# EAGLE schematic Druckluftcontroller (EAGLE 6.5.0)
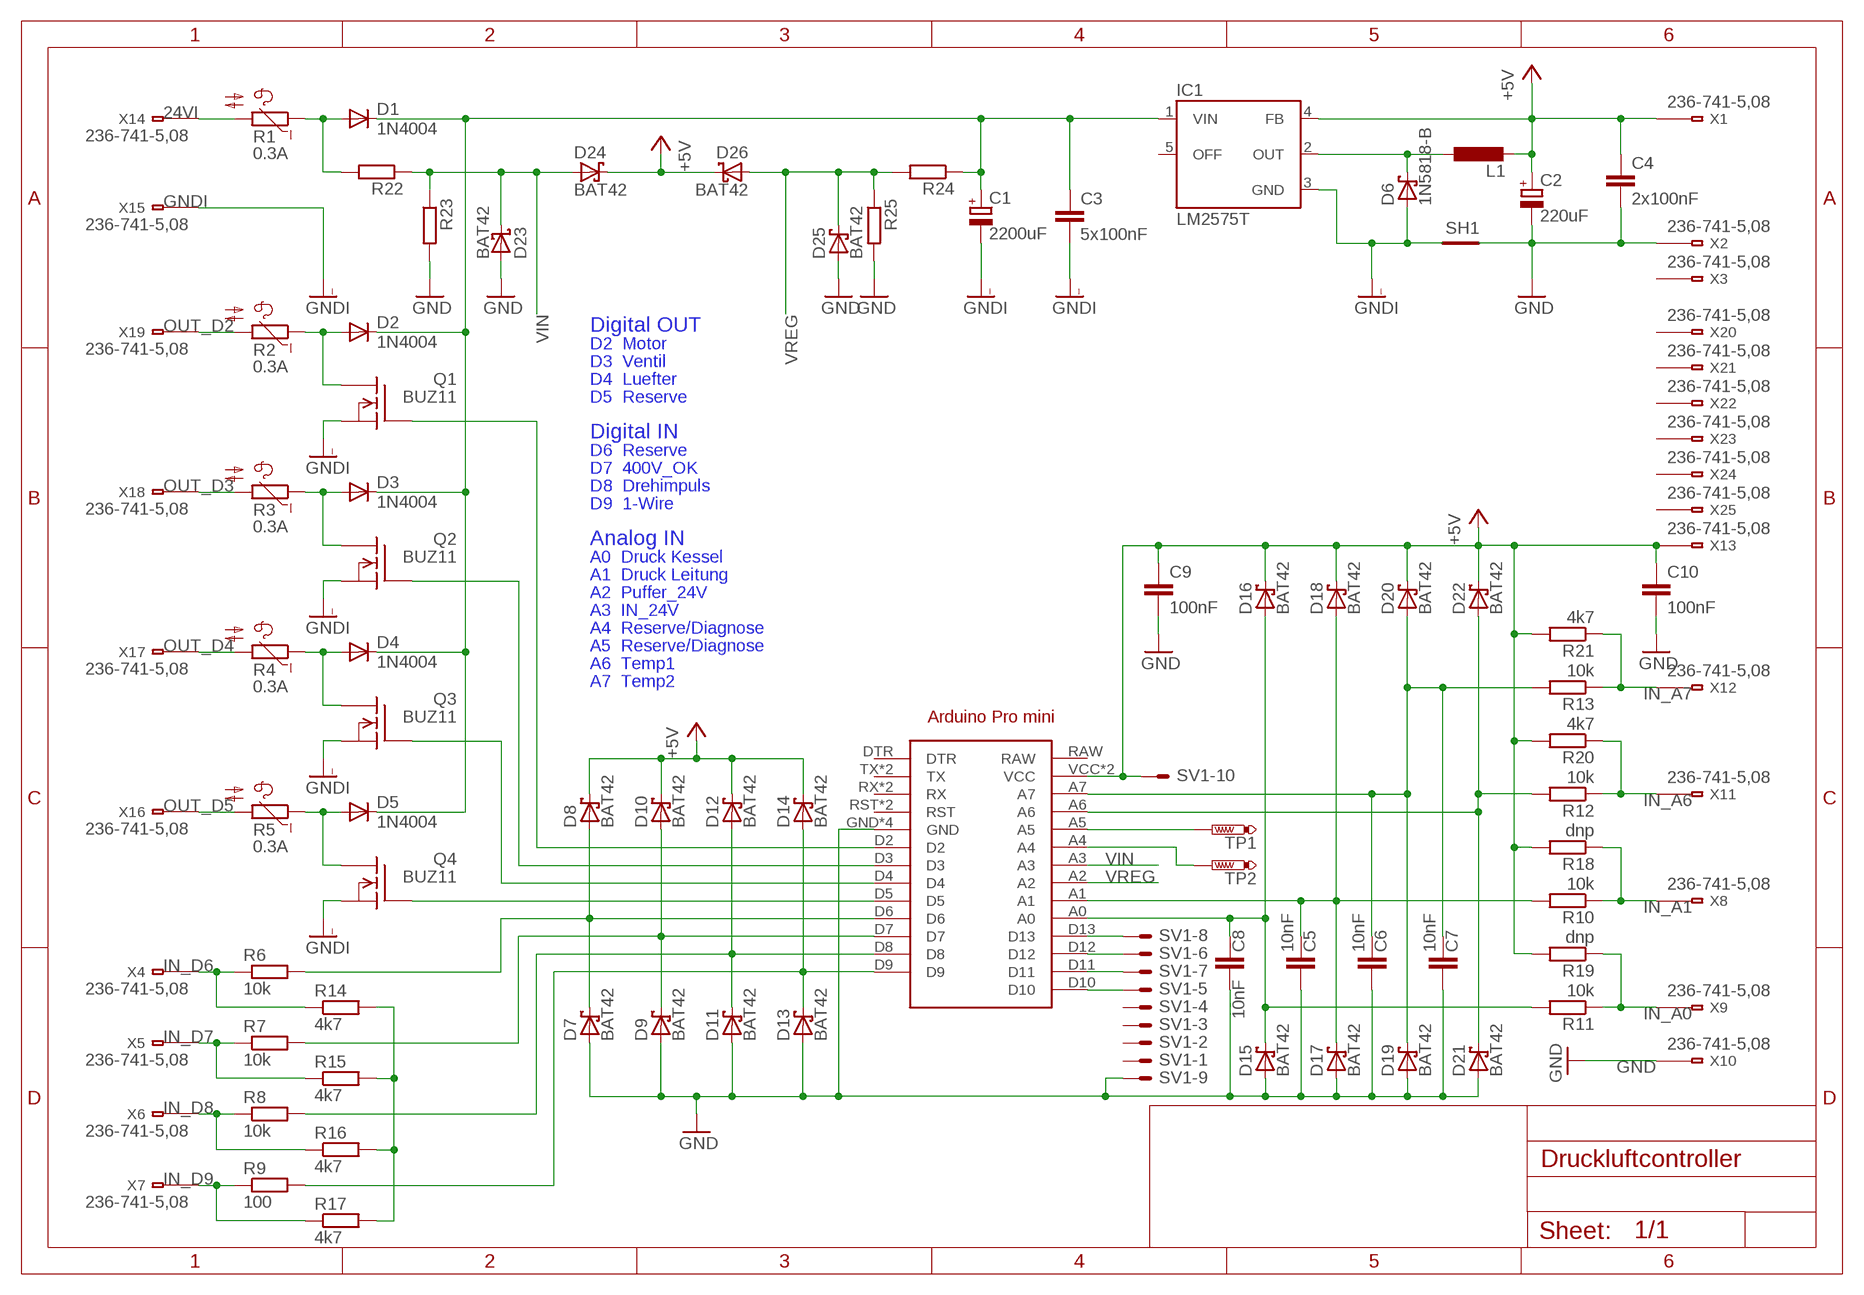
[diagram p0: schematic, sheet 1]

## Parts
ARDUINO1  ARDUINO_PRO_MINI  [ARDUINO_PRO_MINI]
C1  2200uF  CPOL-EUE7.5-16  [E7,5-16]
C2  220uF  CPOL-EUE7.5-16  [E7,5-16]
C3  5x100nF  C-EUC0805  [C0805]
C4  2x100nF  C-EUC0805  [C0805]
C5  10nF  C-EUC0805  [C0805]
C6  10nF  C-EUC0805  [C0805]
C7  10nF  C-EUC0805  [C0805]
C8  10nF  C-EUC0805  [C0805]
C9  100nF  C-EUC0805  [C0805]
C10  100nF  C-EUC0805  [C0805]
D1  1N4004  [DO41-10]
D2  1N4004  [DO41-10]
D3  1N4004  [DO41-10]
D4  1N4004  [DO41-10]
D5  1N4004  [DO41-10]
D6  1N5818-B  [DO41-7.6]
D7  BAT42  [DO35-10]
D8  BAT42  [DO35-10]
D9  BAT42  [DO35-10]
D10  BAT42  [DO35-10]
D11  BAT42  [DO35-10]
D12  BAT42  [DO35-10]
D13  BAT42  [DO35-10]
D14  BAT42  [DO35-10]
D15  BAT42  [DO35-10]
D16  BAT42  [DO35-10]
D17  BAT42  [DO35-10]
D18  BAT42  [DO35-10]
D19  BAT42  [DO35-10]
D20  BAT42  [DO35-10]
D21  BAT42  [DO35-10]
D22  BAT42  [DO35-10]
D23  BAT42  [DO35-10]
D24  BAT42  [DO35-10]
D25  BAT42  [DO35-10]
D26  BAT42  [DO35-10]
IC1  LM2575T  [TO220-5]
L1  L-EUTJ3-U2  [TJ3-U2]
Q1  BUZ11  [TO220]
Q2  BUZ11  [TO220]
Q3  BUZ11  [TO220]
Q4  BUZ11  [TO220]
R1  0.3A  V642  [P642]
R2  0.3A  V642  [P642]
R3  0.3A  V642  [P642]
R4  0.3A  V642  [P642]
R5  0.3A  V642  [P642]
R6  10k  R-EU_0204/7  [0204/7]
R7  10k  R-EU_0204/7  [0204/7]
R8  10k  R-EU_0204/7  [0204/7]
R9  100  R-EU_0204/7  [0204/7]
R10  10k  R-EU_0204/7  [0204/7]
R11  10k  R-EU_0204/7  [0204/7]
R12  10k  R-EU_0204/7  [0204/7]
R13  10k  R-EU_0204/7  [0204/7]
R14  4k7  R-EU_0204/7  [0204/7]
R15  4k7  R-EU_0204/7  [0204/7]
R16  4k7  R-EU_0204/7  [0204/7]
R17  4k7  R-EU_0204/7  [0204/7]
R18  dnp  R-EU_0204/7  [0204/7]
R19  dnp  R-EU_0204/7  [0204/7]
R20  4k7  R-EU_0204/7  [0204/7]
R21  4k7  R-EU_0204/7  [0204/7]
R22  R-EU_0204/7  [0204/7]
R23  R-EU_0204/7  [0204/7]
R24  R-EU_0204/7  [0204/7]
R25  R-EU_0204/7  [0204/7]
SH1  SHORTT5  [SHORT_TOP-50]
SV1  ML10E  [ML10]
TP1  PTR1PAD1-13  [P1-13]
TP2  PTR1PAD1-13  [P1-13]
X1  236-741-5,08  [236-4XX]
X2  236-741-5,08  [236-4XX]
X3  236-741-5,08  [236-4XX]
X4  236-741-5,08  [236-4XX]
X5  236-741-5,08  [236-4XX]
X6  236-741-5,08  [236-4XX]
X7  236-741-5,08  [236-4XX]
X8  236-741-5,08  [236-4XX]
X9  236-741-5,08  [236-4XX]
X10  236-741-5,08  [236-4XX]
X11  236-741-5,08  [236-4XX]
X12  236-741-5,08  [236-4XX]
X13  236-741-5,08  [236-4XX]
X14  236-741-5,08  [236-4XX]
X15  236-741-5,08  [236-4XX]
X16  236-741-5,08  [236-4XX]
X17  236-741-5,08  [236-4XX]
X18  236-741-5,08  [236-4XX]
X19  236-741-5,08  [236-4XX]
X20  236-741-5,08  [236-4XX]
X21  236-741-5,08  [236-4XX]
X22  236-741-5,08  [236-4XX]
X23  236-741-5,08  [236-4XX]
X24  236-741-5,08  [236-4XX]
X25  236-741-5,08  [236-4XX]

## Nets
24VI: R1.2 X14.1@2(B1)
+5V: ARDUINO1.VCC ARDUINO1.VCC@1(VCC) C2.+ C4.1 C9.1 C10.1 D8.C D10.C D12.C D14.C D16.C D18.C D20.C D22.C D24.C D26.C IC1.4(FB) L1.2 R18.2 R19.2 R20.2 R21.2 SV1.10 X1.1@2(B1) X13.1@2(B1)
GND: ARDUINO1.GND ARDUINO1.GND@1(GND) ARDUINO1.GND@2(GND) ARDUINO1.GND@3(GND) C2.- C4.2 C5.2 C6.2 C7.2 C8.2 C9.2 C10.2 D7.A D9.A D11.A D13.A D15.A D17.A D19.A D21.A D23.A D25.A R23.2 R25.2 SH1.2 SV1.9 X2.1@2(B1) X10.1@2(B1)
GNDI: C1.- C3.2 D6.A IC1.3(GND) Q1.3(S) Q2.3(S) Q3.3(S) Q4.3(S) SH1.1 X15.1@2(B1)
IN_A0: R11.1 R19.1 X9.1@2(B1)
IN_A1: R10.1 R18.1 X8.1@2(B1)
IN_A6: R12.1 R20.1 X11.1@2(B1)
IN_A7: R13.1 R21.1 X12.1@2(B1)
IN_D6: R6.1 R14.1 X4.1@2(B1)
IN_D7: R7.1 R15.1 X5.1@2(B1)
IN_D8: R8.1 R16.1 X6.1@2(B1)
IN_D9: R9.1 R17.1 X7.1@2(B1)
N$1: R14.2 R15.2 R16.2 R17.2
N$2: D1.A R1.1 R22.2
N$3: ARDUINO1.D5 Q4.1(G)
N$4: ARDUINO1.A0 C8.1 D15.C D16.A R11.2
N$5: D2.A Q1.2(D) R2.1
N$6: ARDUINO1.D4 Q3.1(G)
N$7: ARDUINO1.D3 Q2.1(G)
N$8: ARDUINO1.A1 C5.1 D17.C D18.A R10.2
N$9: D3.A Q2.2(D) R3.1
N$10: ARDUINO1.D2 Q1.1(G)
N$11: ARDUINO1.A6 D21.C D22.A R12.2
N$12: D4.A Q3.2(D) R4.1
N$13: ARDUINO1.D6 D7.C D8.A R6.2
N$14: ARDUINO1.A4 TP2.TP
N$15: D5.A Q4.2(D) R5.1
N$16: C1.+ C3.1 D1.C D2.C D3.C D4.C D5.C IC1.1(VIN) R24.1
N$17: ARDUINO1.D7 D9.C D10.A R7.2
N$18: ARDUINO1.D8 D11.C D12.A R8.2
N$19: ARDUINO1.D9 D13.C D14.A R9.2
N$20: ARDUINO1.A5 TP1.TP
N$21: ARDUINO1.A7 C6.1 C7.1 D19.C D20.A R13.2
N$24: D6.C IC1.2(OUT) L1.1
N$29: ARDUINO1.D10 SV1.5
N$30: ARDUINO1.D11 SV1.7
N$31: ARDUINO1.D12 SV1.6
N$32: ARDUINO1.D13 SV1.8
OUT_D2: R2.2 X19.1@2(B1)
OUT_D3: R3.2 X18.1@2(B1)
OUT_D4: R4.2 X17.1@2(B1)
OUT_D5: R5.2 X16.1@2(B1)
VIN: ARDUINO1.A3 D23.C D24.A R22.1 R23.1
VREG: ARDUINO1.A2 D25.C D26.A R24.2 R25.1
Unconnected: ARDUINO1.DTR ARDUINO1.RAW ARDUINO1.RST ARDUINO1.RST@1(RST) ARDUINO1.RX ARDUINO1.RX@1(RX) ARDUINO1.TX ARDUINO1.TX@1(TX) IC1.5(OFF) SV1.1 SV1.2 SV1.3 SV1.4 X1.1@1(A1) X2.1@1(A1) X3.1@1(A1) X3.1@2(B1) X4.1@1(A1) X5.1@1(A1) X6.1@1(A1) X7.1@1(A1) X8.1@1(A1) X9.1@1(A1) X10.1@1(A1) X11.1@1(A1) X12.1@1(A1) X13.1@1(A1) X14.1@1(A1) X15.1@1(A1) X16.1@1(A1) X17.1@1(A1) X18.1@1(A1) X19.1@1(A1) X20.1@1(A1) X20.1@2(B1) X21.1@1(A1) X21.1@2(B1) X22.1@1(A1) X22.1@2(B1) X23.1@1(A1) X23.1@2(B1) X24.1@1(A1) X24.1@2(B1) X25.1@1(A1) X25.1@2(B1)

## Notes on the sheet
- Digital OUT
- D2  Motor
- D3  Ventil
- D4  Luefter
- D5  Reserve
- Digital IN
- D6  Reserve
- D7  400V_OK
- D8  Drehimpuls
- D9  1-Wire
- Analog IN
- A0  Druck Kessel
- A1  Druck Leitung
- A2  Puffer_24V
- A3  IN_24V
- A4  Reserve/Diagnose
- A5  Reserve/Diagnose
- A6  Temp1
- A7  Temp2

## Library data of the parts
ARDUINO1 = arduinopromini:ARDUINO_PRO_MINI: For creating Arduino Pro Mini shields
C1 C2 = rcl:CPOL-EU: POLARIZED CAPACITOR, European symbol
C3-C10 = rcl:C-EU: CAPACITOR, European symbol
D1-D5 = diode:1N4004: DIODE general purpose rectifier, 1 A
D6 = diode:1N581*: 1.0A SCHOTTKY BARRIER RECTIFIER Source: http://www.diodes.com/datasheets/ds23001.pdf
D7-D26 = diode:BAT42: DIODE barrier diode
IC1 = v-reg-3:LM2575: National Semiconductor <http://www.national.com> 1.0A "Simple Switcher"(c) 52kHz, Vout 1.23-37V (HV: 57V), Vin 40V (HV: 60V), 50µA standby current
L1 = rcl:L-EU: INDUCTOR, European symbol
Q1-Q4 = transistor-fet:BUZ11: N-Channel Enhancement MOSFET 50V; 30A; 0,040Ohm
R1-R5 = ptc-ntc:V642: VALVO NTC; OC_FARNELL: unknown; OC_NEWARK: unknown
R6-R25 = rcl:R-EU_: RESISTOR, European symbol
SH1 = shorts:SHORT: Short between two nets; BOM: no
SV1 = con-harting-ml:ML10?E: HARTING; OC_FARNELL: unknown; OC_NEWARK: unknown
TP1 TP2 = testpad:PTR1: TEST PIN
X1-X25 = con-wago:236: Anreihbare Einzelklemme 2,5 mm² 16A Rastermaß 5/5,08 | 7,5/7,62 | 10/10,16